# EAGLE design 5VAC-DC (EAGLE 9.6.2)
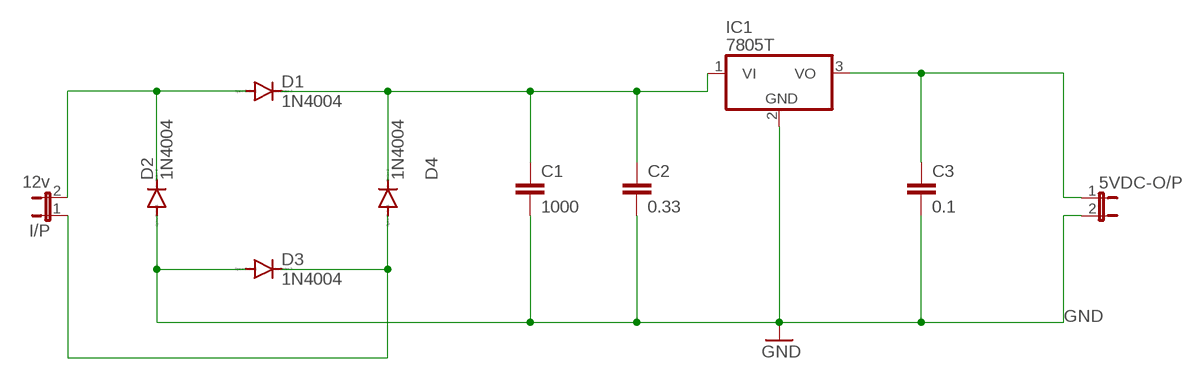
[diagram p0: schematic, sheet 1]

## Parts
5VDC-O/P  JP1E  [JP1]
C1  1000  C2,5-3  [C2.5-3]
C2  0.33  C2,5-3  [C2.5-3]
C3  0.1  C2,5-3  [C2.5-3]
D1  1N4004  [DO41-10]
D2  1N4004  [DO41-10]
D3  1N4004  [DO41-10]
D4  1N4004  [DO41-10]
I/P  12v  JP1E  [JP1]
IC1  7805T  [TO220H]

## Nets
GND: 5VDC-O/P.2 C1.2 C2.2 C3.2 D2.A D3.A IC1.2(GND)
N$1: C1.1 C2.1 D1.C D4.C IC1.1(VI)
N$2: D3.C D4.A I/P.1
N$4: D1.A D2.C I/P.2
N$5: 5VDC-O/P.1 C3.1 IC1.3(VO)

## Library data of the parts
5VDC-O/P I/P = jumper:JP1E: JUMPER
C1-C3 = capacitor-wima:C: CAPACITOR naming: grid - package width
D1-D4 = diode:1N4004: DIODE general purpose rectifier, 1 A
IC1 = linear:78*: Positive VOLTAGE REGULATOR Source: http://cache.national.com/ds/LM/LM78L05.pdf http://www.fairchildsemi.com/ds/LM/LM7805.pdf

## Board
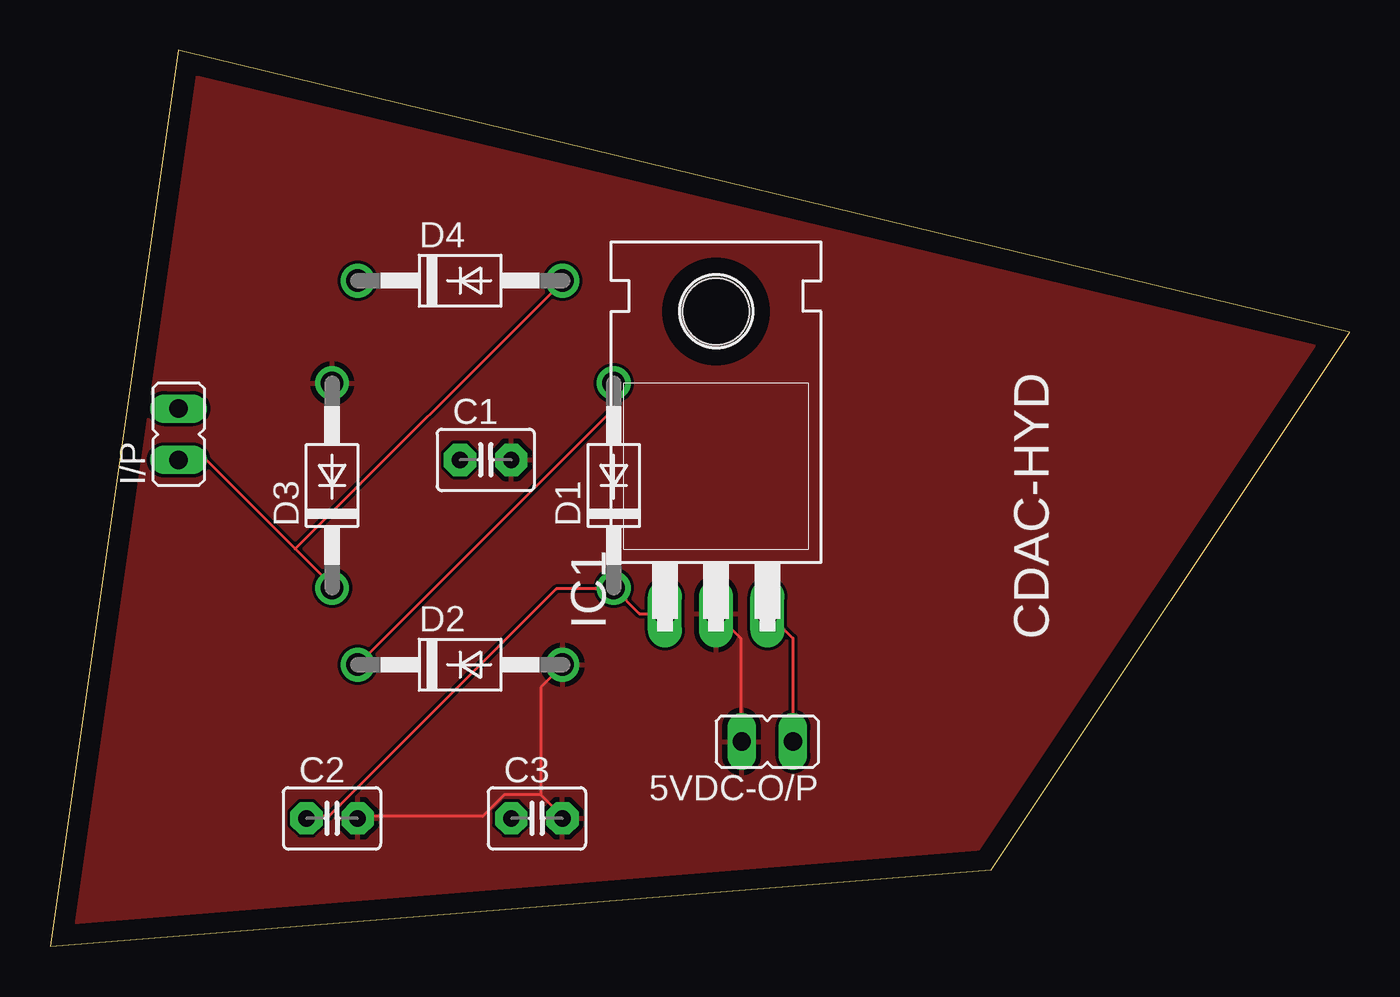
[diagram p1: board, top side]
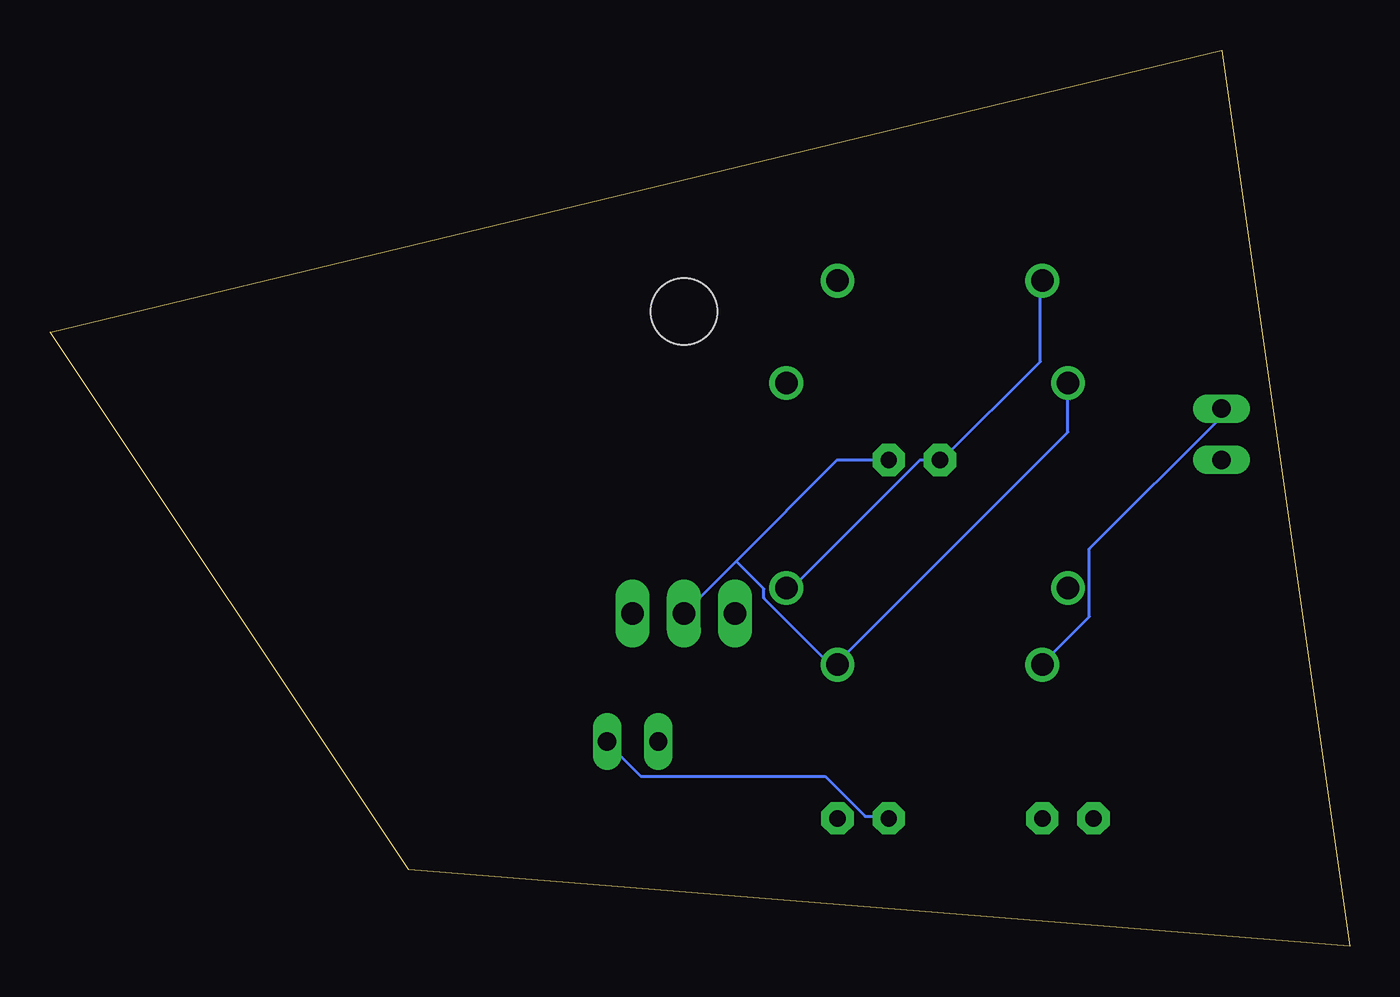
[diagram p2: board, bottom side, seen from below]

Size 64.44 x 44.44 mm. Coordinates in mm from the lower left corner, seen from the top.
Outline: 0,0 46.66,3.81 64.44,30.47 6.35,44.44 0,0
Copper layers (1*16): Top 0.035mm / dielectric 1.5mm / Bottom 0.035mm
Design rules "default": minimum track width 6mil, minimum drill 0.35mm, track to track 6mil, track to pad 6mil, pad to pad 6mil, via to via 6mil, smd to smd 6mil, copper to edge 40mil, drill to drill 6mil, minimum pad ring 10mil, minimum via ring 8mil, stop-mask expansion 4mil, vias tented up to drill 0mil, thermal gap 10mil

### Footprints (pad centres in the part's own frame; a part is rotated, then mirrored left to right if it is on the bottom)
JP1 = drill 0.914 long: 1 0,-1.27; 2 0,1.27
C2.5-3 = drill 0.813 pad 1.6 octagon: 1 -1.27,0; 2 1.27,0
DO41-10 = drill 1.118: A 5.08,0; C -5.08,0
TO220H = drill 1.118 long: 1 -2.54,-10.16; 2 0,-10.16; 3 2.54,-10.16 | hole 3.302: 0,4.826

### Placement (x,y rotation side)
5VDC-O/P  35.56,10.16 90 top
C1  21.59,24.13 0 top
C2  13.97,6.35 0 top
C3  24.13,6.35 0 top
D1  27.94,22.86 90 top
D2  20.32,13.97 0 top
D3  13.97,22.86 90 top
D4  20.32,33.02 0 top
I/P  6.35,25.4 0 top
IC1  33.02,26.67 0 top

### Tracks (layer width: path | path; a pad name or v marks a point on that pad's centre or on a via)
GND
  Top 0.152: IC1.2 34.24,15.29 34.24,10.26 5VDC-O/P.2 | 24.33,7.52 22.5,7.52 21.44,6.45 15.34,6.45 C2.2 | 24.33,7.52 25.4,6.45 C3.2 | 24.33,7.52 24.33,12.85 25.4,13.92 D2.A
  Bottom 0.152: C1.2 25.4,24.13 30.43,19.1 | IC1.2 30.43,19.1 | D3.A 13.97,25.5 25.4,14.07 | 30.43,19.1 29.06,17.73 29.06,17.27 25.86,14.07 25.4,14.07 | 25.4,14.07 D2.A
  pour Top: 1.27,53.34 71.12,53.34 71.12,-2.54 -7.62,-2.54 -7.62,53.34
N$1
  Top 0.152: C2.1 12.75,6.45 13.82,6.45 25.09,17.73 27.84,17.73 D1.C 29.21,16.51 IC1.1
  Bottom 0.152: D1.C 27.84,17.88 27.53,17.88 21.29,24.13 C1.1 20.22,24.13 15.34,29.01 15.34,32.97 D4.C
N$2
  Top 0.152: I/P.1 7.72,24.13 12.14,19.71 | 12.14,19.71 13.97,17.88 D3.C | 12.14,19.71 25.4,32.97 D4.A
N$4
  Top 0.152: D2.C 27.84,26.57 27.84,27.94 D1.A
  Bottom 0.152: I/P.2 6.35,26.26 12.9,19.71 12.9,16.36 15.19,14.07 D2.C
N$5
  Top 0.152: 5VDC-O/P.1 36.83,15.29 35.61,16.51 IC1.3
  Bottom 0.152: C3.1 22.96,6.45 24.03,6.45 26.01,8.43 35.15,8.43 36.83,10.11 5VDC-O/P.1

### Text on the board
tPlace: CDAC-HYD